# Altium schematic sheet lna.SchDoc
size A4
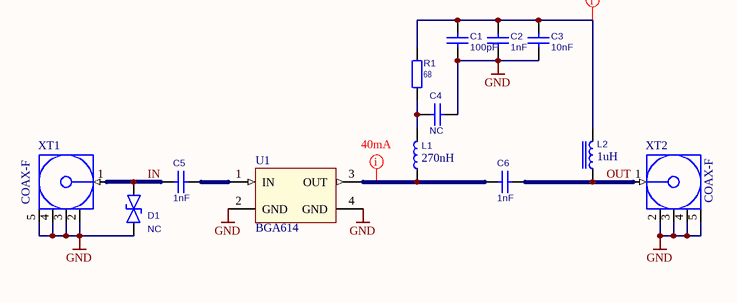
[diagram p0: lna.SchDoc]

## Parts
C1  value 100pF  [C0805]  (hidden comment: CAP_NPOL)
C2  value 1nF  [C0805]  (hidden comment: CAP_NPOL)
C3  value 10nF  [C0805]  (hidden comment: CAP_NPOL)
C4  value NC  [C0805]  (hidden comment: CAP_NPOL)
C5  value 1nF  [C1210]  (hidden comment: CAP_NPOL)
C6  value 1nF  [C1210]  (hidden comment: CAP_NPOL)
D1  NC  [SOD-323]
L1  value 270nH  [IND0603]  (hidden comment: IND_WO_IRON)
L2  value 1uH  [IND0805]  (hidden comment: IND_W_IRON)
R1  68  [R0805]
U1  BGA614  [SOT-343]
XT1  COAX-F  [SMA-16]
XT2  COAX-F  [SMA-16]

## Nets
GND: C1.1 C2.1 C3.1 C4.2 D1.1 U1.2(GND) U1.4(GND) XT1.2(GND) XT1.3(GND) XT1.4(GND) XT1.5(GND) XT2.2(GND) XT2.3(GND) XT2.4(GND) XT2.5(GND)
IN: C5.1 D1.2 XT1.1(Signal)
OUT: C6.2 L2.1 XT2.1(Signal)
NetC1_2: C1.2 C2.2 C3.2 L2.2 R1.2
NetC4_1: C4.1 L1.2 R1.1
NetC5_2: C5.2 U1.1(IN)
NetC6_1: C6.1 L1.1 U1.3(OUT)

## Layout directives
mark named 40mA: NetC6_1
mark named 5V: NetC1_2

## Library data of the parts
D1 = TVS_BIDIR: TVS Diodes; Value: NC
R1 = RESISTOR: RES; Value: 68
U1 = BGA614: Silicon Germanium Broadband MMIC Amplifier; Value: BGA614
XT1 XT2 = COAX-F: RF Coaxial PCB Connector, MCX; Thru-Hole, Right-Angle Mount Socket, Blunt Post Terminal, 50 Ohm Impedance; PCB_Layout: Complies with manufacturer's recommendation.; DrillSize: Corresponds to nominal value.; Published: 15-Jul-2004; LatestRevisionDate: 15-Jul-2004; LatestRevisionNote: Component Replaced.; DatasheetDocument: 30-May-2003; PackageDocument: 04-Jul-1999; PackageReference: 919-119J-51AX; Publisher: Altium Limited; ComponentLink1Description: Manufacturer Link; ComponentLink1URL: http://www.amphenolrf.com/